# EasyEDA Pro project 2230506226.epro

# Schematic SCH_1
Board Name: Board1; Create Date: 2025-04-08; Page Name: P1; Project Name: SCH; Schematic Name: SCH_1; Update Date: 2025-04-08; Company: 嘉立创EDA; Page Size: A4; Version: V1.0
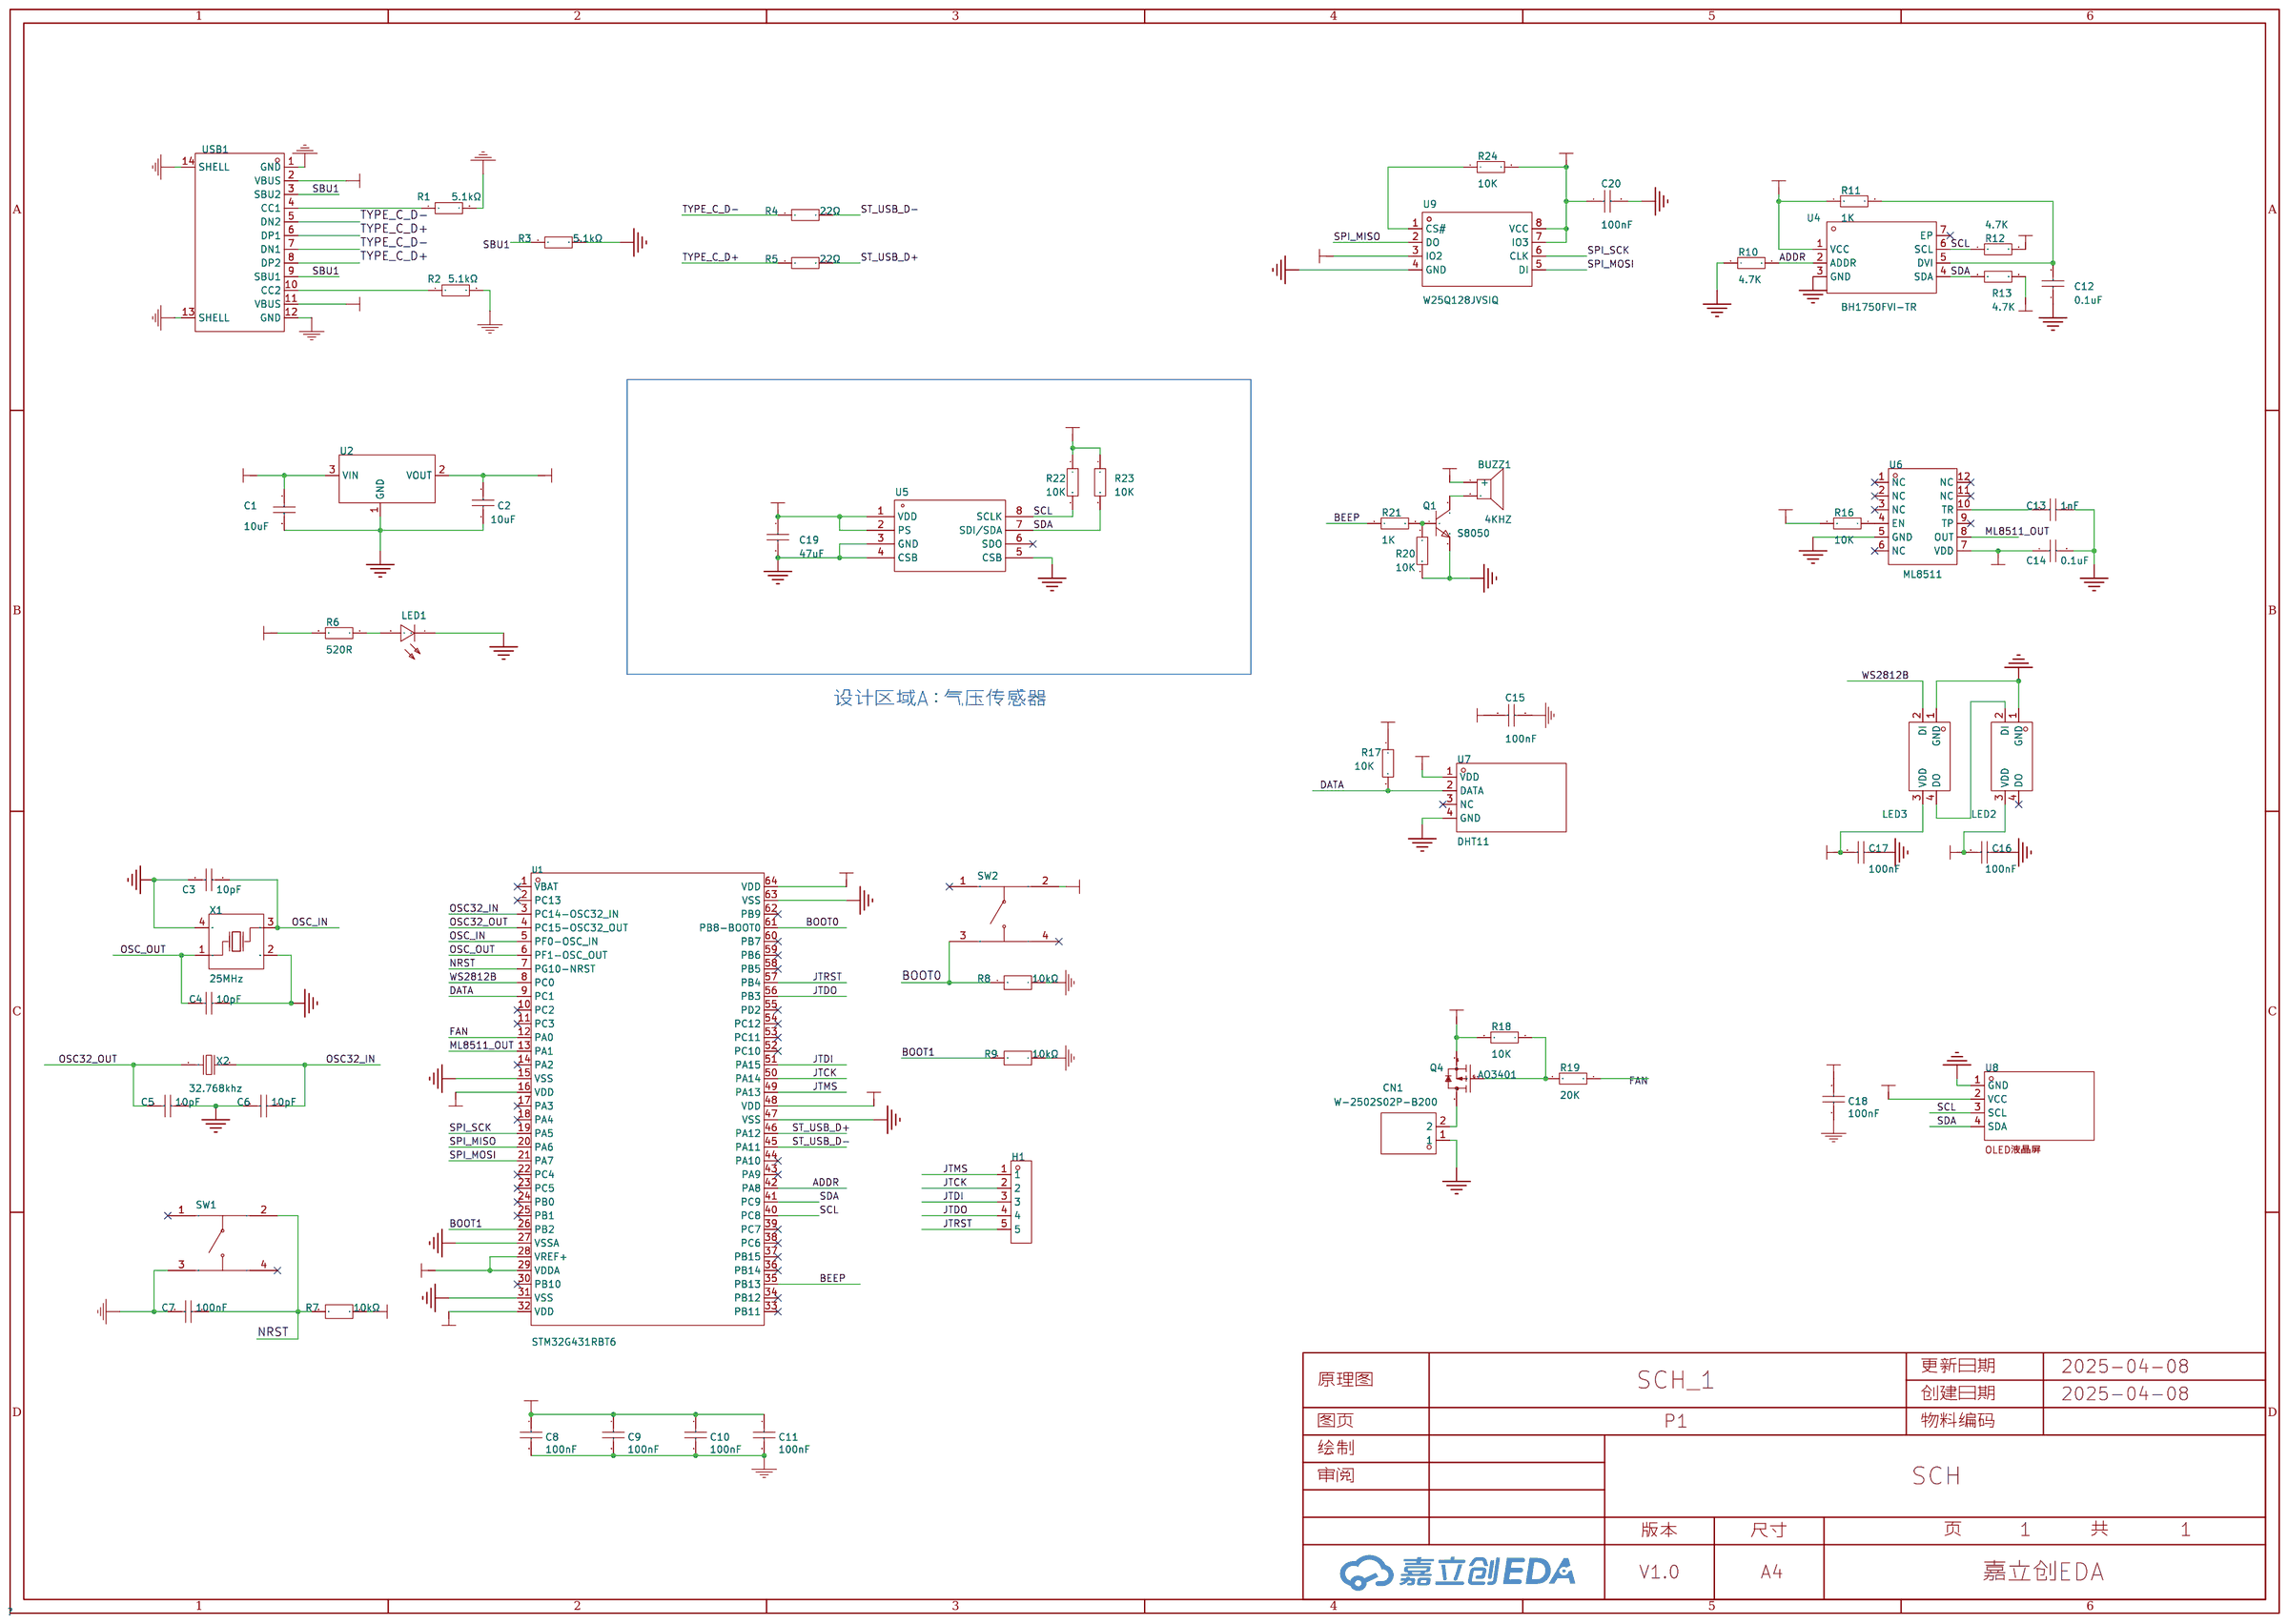
[diagram p0: schematic sheet]

## Parts
BUZZ1  4KHZ  [BUZ-TH_BD12.0-P7.60-D0.6-FD]
C1  10uF  [C0805]
C2  10uF  [C0805]
C3  10pF  [C0805]
C4  10pF  [C0805]
C5  10pF  [C0805]
C6  10pF  [C0805]
C7  100nF  [C0805]
C8  100nF  [C0805]
C9  100nF  [C0805]
C10  100nF  [C0805]
C11  100nF  [C0805]
C12  0.1uF  [C0805]
C13  1nF  [C0805]
C14  0.1uF  [C0805]
C15  100nF  [C0805]
C16  100nF  [C0805]
C17  100nF  [C0805]
C18  100nF  [C0805]
C19  47uF  [C0805]
C20  100nF  [C0805]
CN1  W-2502S02P-B200  [CONN-TH_2P-P2.54_2501S-2P]
H1  -  [5P排针]
LED1  NCD0603R1  [LED0603-RD_RED]
LED2  XL-5050RGBC-WS2812B  [LED-SMD_4P-L5.0-W5.0-BL_XL-5050RGBC]
LED3  XL-5050RGBC-WS2812B  [LED-SMD_4P-L5.0-W5.0-BL_XL-5050RGBC]
Q1  S8050  [SOT-23-3_L2.9-W1.3-P1.90-LS2.4-BR]
Q4  AO3401  [SOT-23-3_L2.9-W1.3-P1.90-LS2.4-BR]
R1  5.1kΩ  [R0805]
R2  5.1kΩ  [R0805]
R3  5.1kΩ  [R0805]
R4  22Ω  [R0805]
R5  22Ω  [R0805]
R6  520R  [R0805]
R7  10kΩ  [R0805]
R8  10kΩ  [R0805]
R9  10kΩ  [R0805]
R10  4.7K  [R0805]
R11  1K  [R0805]
R12  4.7K  [R0805]
R13  4.7K  [R0805]
R16  10K  [R0805]
R17  10K  [R0805]
R18  10K  [R0805]
R19  20K  [R0805]
R20  10K  [R0805]
R21  1K  [R0805]
R22  10K  [R0805]
R23  10K  [R0805]
R24  10K  [R0805]
SW1  TSA017A2540A07  [SW-SMD_4P-L4.2-W3.4-P2.15-LS5.2]
SW2  TSA017A2540A07  [SW-SMD_4P-L4.2-W3.4-P2.15-LS5.2]
U1  STM32G431RBT6  [LQFP-64_L10.0-W10.0-P0.50-LS12.0-BL]
U2  AMS1117-3.3(XBLW)  [SOT-223-3_L6.5-W3.4-P2.30-LS7.0-BR-1]
U4  BH1750FVI-TR  [WSOF-6_L2.6-W1.6-P0.50-TL-EP]
U5  -  [IC-8]
U6  ML8511  [DFN-12_L4.0-W3.7-P1.00-TL]
U7  DHT11  [SENSOR-TH_DHT11]
U8  -  [CONN-TH_4P-P2.54_POGO-4P]
U9  W25Q128JVSIQ  [SOIC-8_L5.3-W5.3-P1.27-LS8.0-BL]
USB1  TYPE-C 16PIN 2MD(073)  [USB-C-SMD_TYPE-C-6PIN-2MD-073]
X1  25MHz  [OSC-SMD_4P-L3.2-W2.5-BL]
X2  32.768kHz  [FC-135R_L3.2-W1.5]

## Library data of the parts
BUZZ1 = TMB12A05_C96093: 驱动方式:有源(内含驱动线路);构造类型:电磁式;频率:2.7kHz;声压(SPL):85dB;; LCSC Part Name: TMB12A05; Supplier Part: C96093; Manufacturer: 华能; Manufacturer Part: TMB12A05; Supplier Footprint: 插件,D=12mm; JLCPCB Part Class: Extended Part; Datasheet: https://atta.szlcsc.com/upload/public/pdf/source/20230426/A4FC10532558AA232D532AB83455FBA4.pdf; Supplier: LCSC; Oscillator Circuit: 有源(内含驱动线路); Technology Type: 电磁式; Operating Voltage: 4V~8V; Sound Pressure Level (SPL): 85dB; Diameter (φD): 12mm; Height: 9.8mm
C1-C6 C12-C14 C16 C17 C19 = CC0805KRX7R9BB104: 容值:100nF;精度:±10%;额定电压:50V;材质(温度系数):X7R;; LCSC Part Name: 100nF ±10% 50V; Supplier Part: C49678; Manufacturer: YAGEO(国巨); Supplier Footprint: 0805; JLCPCB Part Class: 基础库; Datasheet: https://atta.szlcsc.com/upload/public/pdf/source/20180224/C181747_15194369449651363981.pdf; Supplier: LCSC; Tolerance: ±10%; Voltage Rated: 50V; Temperature Coefficient: X7R
C7-C11 C15 C18 C20 = CC0603KRX7R9BB104: 容值:100nF;精度:±10%;额定电压:50V;材质(温度系数):X7R;; LCSC Part Name: 100nF ±10% 50V; Supplier Part: C14663; Manufacturer: YAGEO(国巨); Supplier Footprint: 0603; JLCPCB Part Class: Basic Part; Datasheet: https://atta.szlcsc.com/upload/public/pdf/source/20180910/C282072_33301C7F631E79921B82A8DAC6BCC5B3.pdf; Supplier: LCSC; Tolerance: ±10%; Voltage Rated: 50V; Temperature Coefficient: X7R
CN1 = W-2502S02P-B200: 插针结构:1x2P;间距:2.5mm;安装方式:-;参考系列:XH;总PIN数:2P;排数:1;每排PIN数:2;行距:-;触头材质:黄铜;; LCSC Part Name: 系列:XH 间距:2.5mm 1x2P; Supplier Part: C132463; Manufacturer: Ckmtw(灿科盟); Supplier Footprint: 插件,P=2.5mm; JLCPCB Part Class: Extended Part; Datasheet: https://atta.szlcsc.com/upload/public/pdf/source/20180112/C169006_15157258886881261764.pdf; Supplier: LCSC; Pins Structure: 1x2P; Pitch: 2.5mm; Reference Series: XH; Number of Pins: 2P; Number of Rows: 1; Number of PINs Per Row: 2; Contact Material: 黄铜
H1 = 5P排针: Supplier: LCSC; Supplier Part: C168673; Manufacturer: Amphenol ICC; Manufacturer Part: 68000-102HLF; _: 3
LED1 = NCD0603R1_C84263: 灯头类型:-;发光颜色:红色;正向电压(VF):1.6V~2.6V;功率:65mW;正向电流:20mA;主波长:615nm~630nm;二极管配置:独立二极管;透镜颜色:无色透明透镜;色温:-;发光强度:80mcd~220mcd;发光角度:130°;载带方式:-;工作温度:-30℃~+85℃;; Supplier Part: C84263; Manufacturer: 国星光电; Supplier Footprint: 0603; JLCPCB Part Class: Extended Part; Datasheet: https://atta.szlcsc.com/upload/public/pdf/source/20200820/C84263_DABC6A75E58F576973B407FDBA283D60.pdf; Supplier: LCSC; Emitted Color: 红色; Forward Voltage (VF): 1.6V~2.6V; Power Dissipation: 65mW; Forward Current: 20mA; Dominant Wavelength: 615nm~630nm; Diode Configuration: 独立二极管; Lens Color: 无色透明透镜; Luminous Intensity: 80mcd~220mcd; Viewing Angle: 130°; Operating Temperature: -30℃~+85℃
LED2 LED3 = XL-5050RGBC-WS2812B: 5050七彩幻彩透明贴片LED灯珠 5050 幻彩透明四脚 ws2812B 内置驱动IC; Supplier Part: C2843785; Manufacturer: XINGLIGHT(成兴光); Supplier Footprint: SMD5050; JLCPCB Part Class: Extended Part; Datasheet: https://atta.szlcsc.com/upload/public/pdf/source/20240412/E1004CAA80592E31D08BFE019083806F.pdf; Supplier: LCSC; Emitted Color: RGB三色; Diode Configuration: 共阳极; Dominant Wavelength: 618nm~623nm；520nm~525nm；467nm~472nm; Peak Wavelength: 525nm；623nm；472nm; Forward Current: 20mA; Forward Voltage (VF): 3.4V；3.4V；2.4V; Luminous Intensity: 143mcd；240mcd；845mcd; Power Dissipation: 50mW；50mW；45mW; Viewing Angle: 120°; Mounting Sytle: 正贴; Operating Temperature: -25℃~+80℃
Q1 = S8050_C20069125: 晶体管类型:NPN;集电极电流(Ic):500mA;集射极击穿电压(Vceo):25V;功率(Pd):300mW;直流电流增益(hFE@Ic,Vce):120@50mA,1.0V;; LCSC Part Name: NPN 电流:500mA 耐压:25V; Supplier Part: C20069125; Manufacturer: 宏迦橙; Supplier Footprint: SOT-23; JLCPCB Part Class: Extended Part; Datasheet: https://atta.szlcsc.com/upload/public/pdf/source/20240403/2D78449C96B6E27F13BF8BDF79E27159.pdf; Supplier: LCSC; Transistor Type: NPN; Collector Current (Ic): 500mA; Collector-Emitter Breakdown Voltage (Vceo): 25V; Power Dissipation (Pd): 300mW; DC Current Gain (hFE@Ic,Vce): 120@50mA,1.0V; Transition Frequency (fT): 100MHz; Collector Cut-Off Current (Icbo): 100nA; Collector-Emitter Saturation Voltage (VCE(sat)@Ic,Ib): 600mV@500mA,50mA; Operating Temperature: -55℃~+150℃
Q4 = AO3401_C181091: 类型:1个P沟道;漏源电压(Vdss):30V;连续漏极电流(Id):4.2A;功率(Pd):350mW;导通电阻(RDS(on)@Vgs,Id):65mΩ@10V,4.2A;阈值电压(Vgs(th)@Id):1.3V@250uA;; LCSC Part Name: 1个P沟道 耐压:30V 电流:4.2A; Supplier Part: C181091; Manufacturer: Hottech(合科泰); Supplier Footprint: SOT-23; JLCPCB Part Class: 扩展库; Datasheet: https://atta.szlcsc.com/upload/public/pdf/source/20180131/C181091_15173931948391329220.pdf; Supplier: LCSC; Type: 1个P沟道; Drain Source Voltage (Vdss): 30V; Continuous Drain Current (Id): 4.2A; Power Dissipation (Pd): 350mW; Drain Source On Resistance (RDS(on)@Vgs,Id): 65mΩ@10V,4.2A; Gate Threshold Voltage (Vgs(th)@Id): 1.3V@250uA
R1-R3 = 0603WAF5101T5E: 电阻类型:厚膜电阻;阻值:5.1kΩ;精度:±1%;功率:100mW;最大工作电压:75V;温度系数:±100ppm/℃;; LCSC Part Name: 5.1kΩ ±1% 100mW 厚膜电阻; Supplier Part: C23186; Manufacturer: UNI-ROYAL(厚声); Supplier Footprint: 0603; JLCPCB Part Class: Basic Part; Datasheet: https://atta.szlcsc.com/upload/public/pdf/source/20200306/C422600_1E6D84923E4A46A82E41ADD87F860B5C.pdf; Supplier: LCSC; Type: 厚膜电阻; Tolerance: ±1%; Power(Watts): 100mW; Overload Voltage (Max): 75V; Temperature Coefficient: ±100ppm/℃; Operating Temperature Range: -55℃~+155℃
R4 R5 = 0603WAF220JT5E: 电阻类型:厚膜电阻;阻值:22Ω;精度:±1%;功率:100mW;最大工作电压:75V;温度系数:±100ppm/℃;; LCSC Part Name: 22Ω ±1% 100mW 厚膜电阻; Supplier Part: C23345; Manufacturer: UNI-ROYAL(厚声); Supplier Footprint: 0603; JLCPCB Part Class: Basic Part; Datasheet: https://atta.szlcsc.com/upload/public/pdf/source/20200306/C422600_1E6D84923E4A46A82E41ADD87F860B5C.pdf; Supplier: LCSC; Type: 厚膜电阻; Tolerance: ±1%; Power(Watts): 100mW; Overload Voltage (Max): 75V; Temperature Coefficient: ±100ppm/℃; Operating Temperature Range: -55℃~+155℃
R6 R16 = RC0402FR-0710KL: 电阻类型:厚膜电阻;阻值:10kΩ;精度:±1%;功率:62.5mW;; LCSC Part Name: 10kΩ ±1% 62.5mW; Supplier Part: C60490; Manufacturer: YAGEO(国巨); Supplier Footprint: 0402; JLCPCB Part Class: Extended Part; Datasheet: https://atta.szlcsc.com/upload/public/pdf/source/20170606/1496716515432.pdf; Supplier: LCSC; Type: 厚膜电阻; Tolerance: ±1%; Power(Watts): 62.5mW; Temperature Coefficient: ±100ppm/℃; Overload Voltage (Max): 50V; Operating Temperature Range: -55℃~+155℃
R7-R9 = 0603WAF1002T5E: 电阻类型:厚膜电阻;阻值:10kΩ;精度:±1%;功率:100mW;最大工作电压:75V;温度系数:±100ppm/℃;; LCSC Part Name: 厚膜电阻 10kΩ ±1% 100mW; Supplier Part: C25804; Manufacturer: UNI-ROYAL(厚声); Supplier Footprint: 0603; JLCPCB Part Class: Basic Part; Datasheet: https://atta.szlcsc.com/upload/public/pdf/source/20200306/C422600_1E6D84923E4A46A82E41ADD87F860B5C.pdf; Supplier: LCSC; Type: 厚膜电阻; Tolerance: ±1%; Power(Watts): 100mW; Overload Voltage (Max): 75V; Temperature Coefficient: ±100ppm/℃; Operating Temperature Range: -55℃~+155℃
R10-R13 R17 R20-R24 = Res_0805: Supplier Footprint: 0805
R18 R19 = Res_0603: Supplier Footprint: 0603
SW1 SW2 = TSA017A2540A07: 按钮形状:椭圆形按钮;作用力:400gf;安装方式:立贴;开关长度:4.2mm;开关宽度:3.35mm;开关高度:2.5mm;触点电流:50mA;额定电压(AC):-;额定电压(DC):12V;机械寿命:-;; LCSC Part Name: 4.2*3.35*2.5mm 立贴 轻触开关; Supplier Part: C2888434; Manufacturer: BZCN(博众电气); Supplier Footprint: SMD; JLCPCB Part Class: 扩展库; Datasheet: https://atta.szlcsc.com/upload/public/pdf/source/20210906/F29F74F1A6DE5E6C38338EAD973C3529.pdf; Supplier: LCSC; Actuator Style: 椭圆形按钮; Operating Force: 400gf; Mounting Style: 立贴; Switch Length: 4.2mm; Switch Width: 3.35mm; Switch Height: 2.5mm; Contact Current: 50mA; Voltage Rating (DC): 12V; Actuator/Cap Color: 白色
U1 = STM32G431RBT6: CPU内核:ARM-M系列;程序存储容量:128KB;GPIO端口数量:52;工作电压范围:1.71V~3.6V;CPU最大主频:170MHz;; Supplier Part: C431633; Manufacturer: ST(意法半导体); Supplier Footprint: LQFP-64(10x10); JLCPCB Part Class: 扩展库; Datasheet: https://atta.szlcsc.com/upload/public/pdf/source/20190925/C431633_8068E60CC825A086DCCD86A4BDED9458.pdf; Supplier: LCSC; CPU Core: ARM-M系列; Program Storage Size: 128KB; GPIO Ports Number: 52; Operating Voltage Range: 1.71V~3.6V; CPU Maximum Speed: 170MHz; Operating Temperature Range: -40℃~+85℃; ADC (Bit): 12bit; DAC (Bit): 12bit; Watchdog: 有; Infrared Data Association: 有; Low-Voltage Detect: 有; Direct Memory Access: 有; Internal Oscillator: 有
U2 = AMS1117-3.3(XBLW)_C18906017: 最大输入电压:15V;输出电压:3.3V;最大输出电流:1A;电源纹波抑制比(PSRR):60dB;; Supplier Part: C18906017; Manufacturer: XBLW(芯伯乐); Supplier Footprint: SOT-223; JLCPCB Part Class: 扩展库; Datasheet: https://atta.szlcsc.com/upload/public/pdf/source/20231019/F4230EEFC48908FC91962BB59ACA9AD6.pdf; Supplier: LCSC; Maximum Input Voltage: 15V; Output Voltage: 3.3V; MAX Output Current: 1A; Power Supply Rejection Ratio (PSRR): 60dB; standby current: 4mA; Operating Temperature: -40℃~+125℃; Number of Outputs: 1
U4 = BH1750FVI-TR: 检测颜色:-;接口类型:I2C;分辨率(位):16;; Supplier Part: C78960; Manufacturer: ROHM(罗姆); Supplier Footprint: WSOF-6; Datasheet: https://atta.szlcsc.com/upload/public/pdf/source/20160723/1469258984787.pdf; Supplier: LCSC; Interface Type: I2C; Supply Voltage: 2.4V~3.6V; Resolution: 16; Operating Temperature: -40℃~+85℃
U5 = IC-8
U6 = ML8511_REFBOARD: Supplier Part: C19501581; Manufacturer: ROHM(罗姆); JLCPCB Part Class: 扩展库; Datasheet: https://atta.szlcsc.com/upload/public/pdf/source/20231221/86F2DBEAA739866045DC95770D30AEE3.pdf; Supplier: LCSC
U7 = DHT11: 新款电容式数字温湿度传感器,老款已停产16.1x12.6x5.8mm; Supplier: LCSC; Supplier Part: C117051; Manufacturer: 广州奥松; LCSC Part Name: DHT11  电容式传感器; Supplier Footprint: SIP-4; Datasheet: https://atta.szlcsc.com/upload/public/pdf/source/20170703/1499081238365.pdf
U8 = OLED液晶屏
U9 = W25Q128JVSIQ: 存储器构架(格式):FLASH;存储器接口类型:SPI - Dual/Quad I/O;存储器容量:128Mb (16M x 8);; Supplier Part: C97521; Manufacturer: WINBOND(华邦); Supplier Footprint: SOIC-8_208mil; JLCPCB Part Class: Basic Part; Datasheet: https://atta.szlcsc.com/upload/public/pdf/source/20170316/1489627409956.pdf; Supplier: LCSC; Memory Format: FLASH; Memory Interface: SPI - Dual/Quad I/O; Memory Size: 128Mb (16M x 8); Voltage - Supply: 2.7V ~ 3.6V
USB1 = TYPE-C 16PIN 2MD(073): 连接器类型:Type-C;标准:-;公母:母;端口数量:1;触点数量:16P;安装方式:卧贴;额定电流 - 电源:5A;工作温度范围:-25℃~+85℃;; LCSC Part Name: Type-C 母 卧贴; Supplier Part: C2765186; Manufacturer: SHOU HAN(首韩); Supplier Footprint: SMD; JLCPCB Part Class: Extended Part; Datasheet: https://atta.szlcsc.com/upload/public/pdf/source/20211123/39B17C16241EAC15C5E277BDA434118E.pdf; Supplier: LCSC; Connector Type: Type-C; Gender: 母; Number of Ports: 1; Number of Contacts: 16P; Mounting Style: 卧贴; Current Rating - Power (Max): 5A; Operating Temperature Range: -25℃~+85℃
X1 = X322525MOB4SI: 晶振类型:贴片晶振;频率:25MHz;常温频差:±10ppm;外接负载电容:12pF;频率稳定度(全温):±20ppm;; LCSC Part Name: 25MHz ±10ppm 12pF; Supplier Part: C9006; Manufacturer: YXC(扬兴晶振); Supplier Footprint: SMD3225-4P; JLCPCB Part Class: 基础库; Datasheet: https://atta.szlcsc.com/upload/public/pdf/source/20240329/19D5F850207469550BEB00D7DFEDBC7A.pdf; Supplier: LCSC; Crystal Type: 贴片晶振; Normal temperature Frequency Tolerance: ±10ppm; External load capacitor: 12pF; Frequency Stability(Full temperature range): ±20ppm; Operating Temperature: -40℃~+85℃
X2 = Q13FC1350000400: 频率:32.768kHz;晶振类型:贴片无源晶振;负载电容:12.5pF;等效串联电阻(ESR):70kΩ;频率公差:±20ppm;频率稳定度:-;工作温度:-40℃~+85℃;; LCSC Part Name: FC-135  32.768KHz ±20ppm 12.5pF; Supplier Part: C32346; Manufacturer: EPSON(爱普生); LCSC On Sale: 1; Supplier Footprint: SMD3215-2P; Price: 3.35; JLCPCB On Sale: 1; Datasheet: https://atta.szlcsc.com/upload/public/pdf/source/20190108/C32346_746D6B07EAF90824457A96480007685F.pdf; Supplier: LCSC; Operating Temperature: -40℃~+85℃; Crystal Type: 贴片无源晶振; Load Capacitance: 12.5pF; Equivalent Series Resistance (ESR): 70kΩ; Frequency Tolerance: ±20ppm

## Nets
3.3V: BUZZ1.1(+) C2.2 C8.1 C9.1 C10.1 C11.1 C14.1 C15.1 C18.1 C19.1 C20.1 R6.2 R7.1 R11.1 R12.2 R13.2 R16.2 R17.1 R22.1 R23.1 R24.2 SW2.2 U1.16(VDD) U1.28(VREF+) U1.29(VDDA) U1.32(VDD) U1.48(VDD) U1.64(VDD) U2.2(VOUT) U4.1(VCC) U5.1(VDD) U5.2(PS) U6.7(VDD) U7.1(VDD) U8.2(VCC) U9.3(IO2) U9.7(IO3) U9.8(VCC)
5V: C1.1 C16.2 C17.2 LED2.3(VDD) LED3.3(VDD) Q4.2(S) R18.2 U2.3(VIN) USB1.2(VBUS) USB1.11(VBUS)
GND: C1.2 C2.1 C3.1 C4.1 C5.1 C6.2 C7.2 C8.2 C9.2 C10.2 C11.2 C12.1 C13.1 C14.2 C15.2 C16.1 C17.1 C18.2 C19.2 C20.2 CN1.1 LED1.1(K) LED2.1(GND) LED3.1(GND) Q1.2 R1.2 R2.2 R3.2 R8.1 R9.1 R10.1 R20.2 SW1.3 U1.15(VSS) U1.27(VSSA) U1.31(VSS) U1.47(VSS) U1.63(VSS) U2.1(GND) U4.3(GND) U5.3(GND) U5.4(CSB) U5.5(CSB) U6.5(GND) U7.4(GND) U8.1(GND) U9.4(GND) USB1.1(GND) USB1.12(GND) USB1.13(SHELL) USB1.14(SHELL) X1.2(GND) X1.4(GND)
ADDR: R10.2 U1.42(PA8) U4.2(ADDR)
BEEP: R21.1 U1.35(PB13)
BOOT0: R8.2 SW2.3 U1.61(PB8-BOOT0)
BOOT1: R9.2 U1.26(PB2)
DATA: R17.2 U1.9(PC1) U7.2(DATA)
FAN: R19.1 U1.12(PA0)
JTCK: H1.2 U1.50(PA14)
JTDI: H1.3 U1.51(PA15)
JTDO: H1.4 U1.56(PB3)
JTMS: H1.1 U1.49(PA13)
JTRST: H1.5 U1.57(PB4)
ML8511_OUT: U1.13(PA1) U6.8(OUT)
NRST: C7.1 R7.2 SW1.2 U1.7(PG10-NRST)
OSC32_IN: C6.1 U1.3(PC14-OSC32_IN) X2.2
OSC32_OUT: C5.2 U1.4(PC15-OSC32_OUT) X2.1
OSC_IN: C3.2 U1.5(PF0-OSC_IN) X1.3(OSC2)
OSC_OUT: C4.2 U1.6(PF1-OSC_OUT) X1.1(OSC1)
SBU1: R3.1 USB1.3(SBU2) USB1.9(SBU1)
SCL: R12.1 R22.2 U1.40(PC8) U4.6(SCL) U5.8(SCLK) U8.3(SCL)
SDA: R13.1 R23.2 U1.41(PC9) U4.4(SDA) U5.7(SDI/SDA) U8.4(SDA)
SPI_MISO: U1.20(PA6) U9.2(DO)
SPI_MOSI: U1.21(PA7) U9.5(DI)
SPI_SCK: U1.19(PA5) U9.6(CLK)
ST_USB_D+: R5.2 U1.46(PA12)
ST_USB_D-: R4.2 U1.45(PA11)
TYPE_C_D+: R5.1 USB1.6(DP1) USB1.8(DP2)
TYPE_C_D-: R4.1 USB1.5(DN2) USB1.7(DN1)
WS2812B: LED3.2(DI) U1.8(PC0)
$1N2884: R1.1 USB1.4(CC1)
$1N2893: R2.1 USB1.10(CC2)
$1N3702: C12.2 R11.2 U4.5(DVI)
$1N3835: LED1.2(A) R6.1
$1N4038: CN1.2 Q4.3(D)
$1N4040: Q4.1(G) R18.1 R19.2
$1N4351: C13.2 U6.10(TR)
$1N4422: R16.1 U6.4(EN)
$1N4931: LED2.2(DI) LED3.4(DO)
$1N5246: Q1.1 R20.1 R21.2
$1N5250: BUZZ1.2 Q1.3
$1N13142: R24.1 U9.1(CS#)

Not connected (* = marked no-connect by the designer): LED2 4(DO)*; SW1 1* 4*; SW2 1* 4*; U1 1(VBAT)* 2(PC13)* 10(PC2)* 11(PC3)* 14(PA2)* 17(PA3)* 18(PA4)* 22(PC4)* 23(PC5)* 24(PB0)* 25(PB1)* 30(PB10)* 33(PB11)* 34(PB12)* 36(PB14)* 37(PB15)* 38(PC6)* 39(PC7)* 43(PA9)* 44(PA10)* 52(PC10)* 53(PC11)* 54(PC12)* 55(PD2)* 58(PB5)* 59(PB6)* 60(PB7)* 62(PB9)*; U4 7(EP)*; U5 6(SDO)*; U6 1(NC)* 2(NC)* 3(NC)* 6(NC)* 9(TP)* 11(NC)* 12(NC)*; U7 3(NC)*

## Notes on the sheet
- 设计区域A：气压传感器

# Board PCB_1
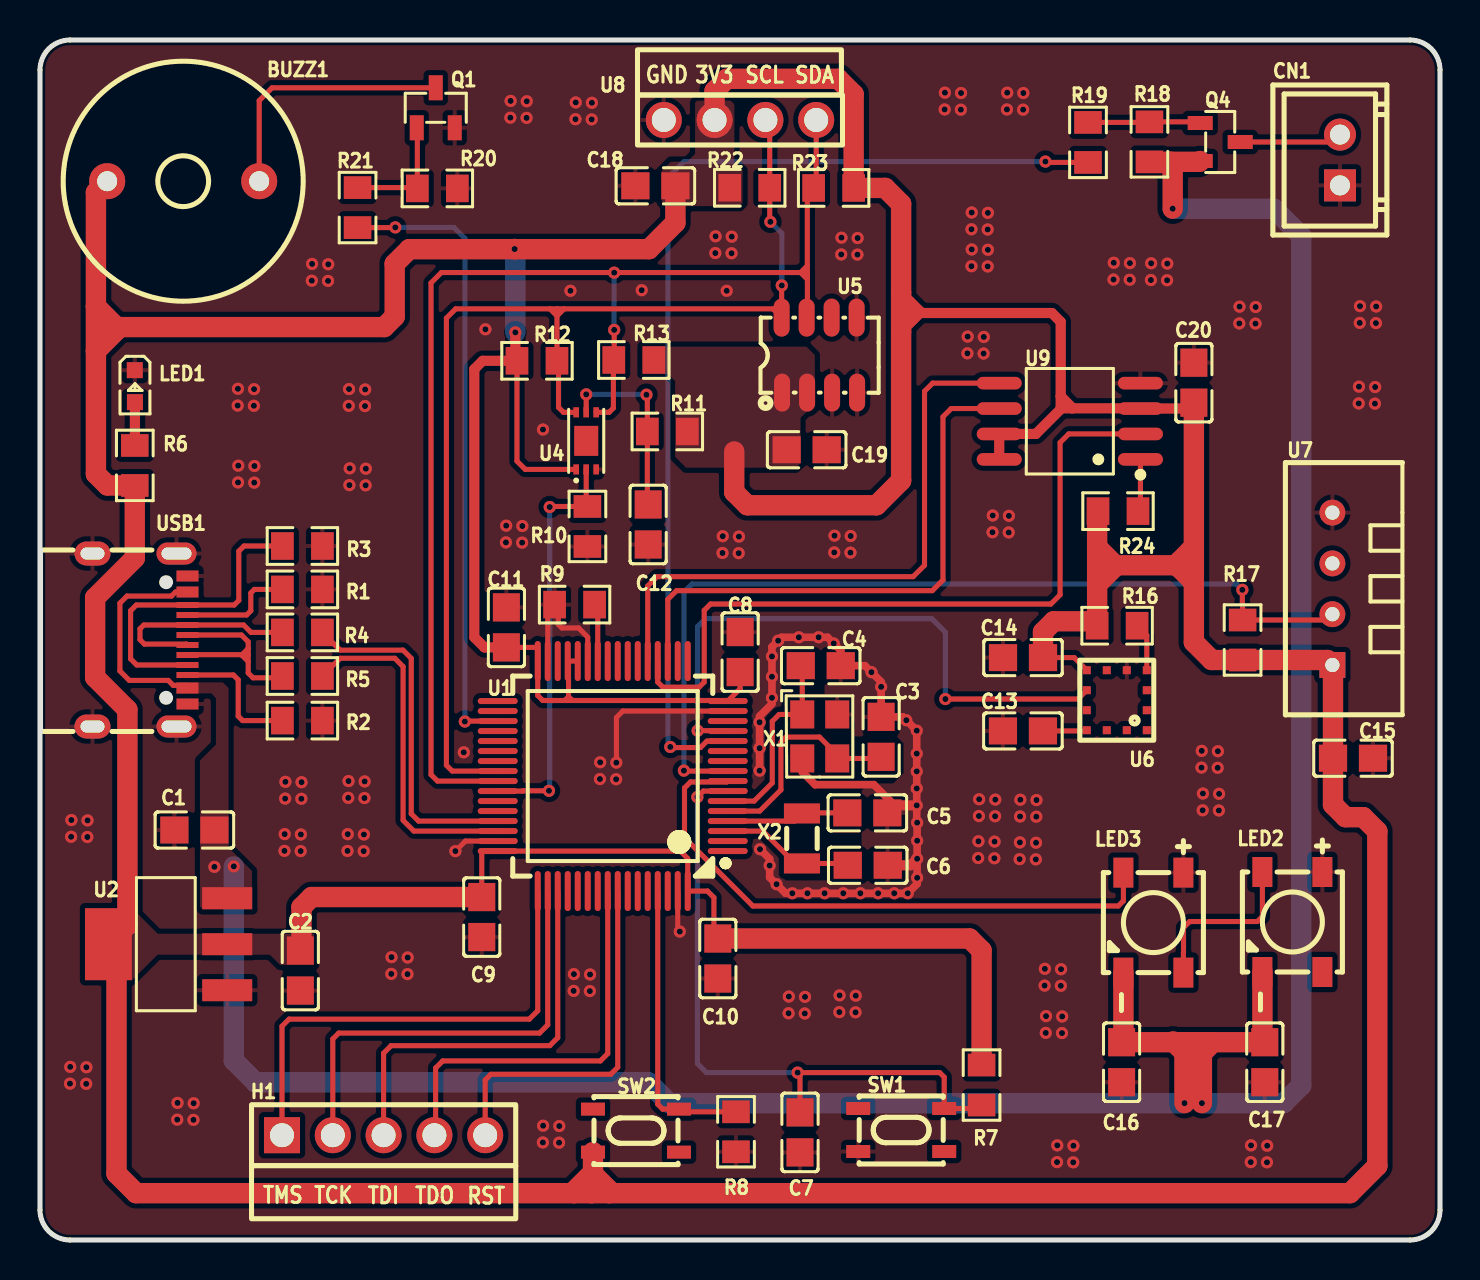
[diagram p1: board, top side]
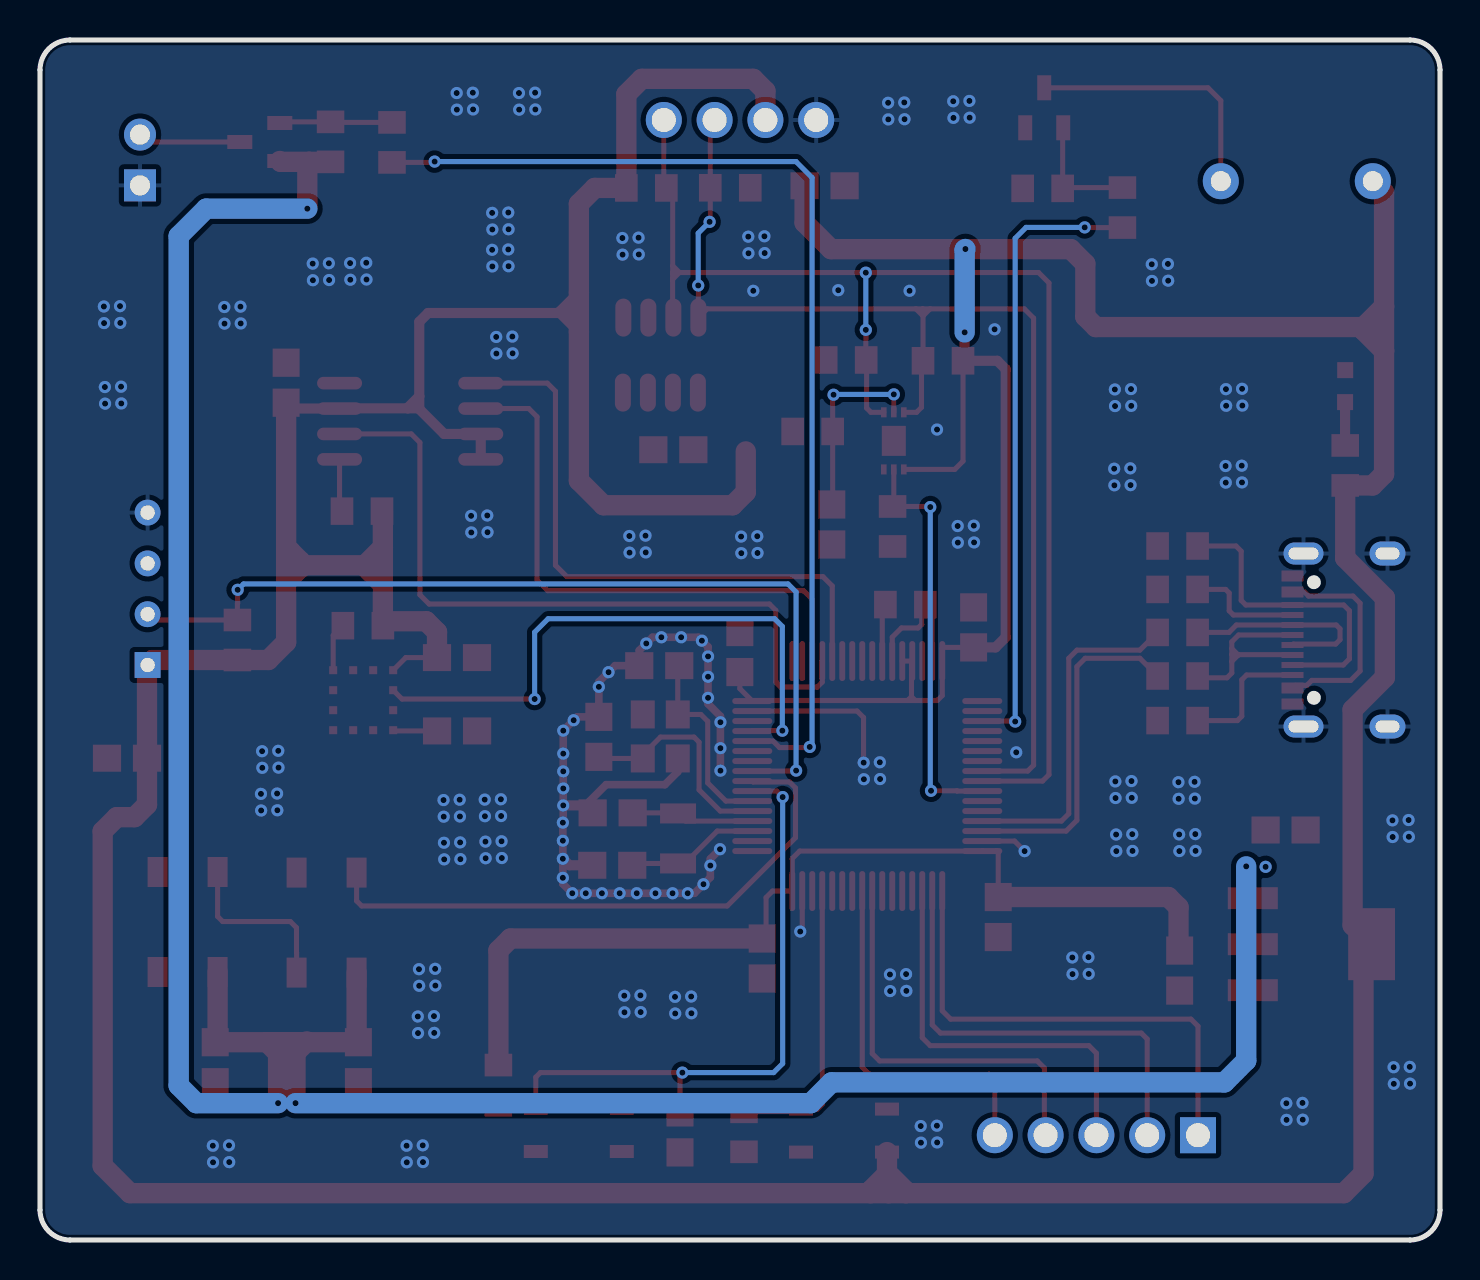
[diagram p2: board, bottom side, seen from below]

Outline 70 x 60 mm; copper layers: Top Layer, Bottom Layer. Coordinates in mm from the lower left corner of the outline.
Outline path: 0,58.5 0,1.5 arc(0.44,0.44) 1.5,0 68.5,0 arc(69.56,0.44) 70,1.5 70,58.5 arc(69.56,59.56) 68.5,60 1.5,60 arc(0.44,59.56) 0,58.5
Stack: Top Layer 0.035mm / Dielectric1 1.51mm FR4 er 4.5 / Bottom Layer 0.035mm

## Design rules (mm)
net ST_USB_D-: USB1
net TYPE_C_D-: USB
net ST_USB_D+: USB1
net TYPE_C_D+: USB
template: 自定义配置
spacing copperThickness1oz (default): track to track 0.178, other pairs 0.152 to 0.203
spacing copperThickness2oz: track to track 0.203, other pairs 0.152 to 0.3
track width copperThickness1oz (default): min 0.254, default 0.254, max 2.54
track width pwr: min 0.203, default 1.016, max 2.54
differential pair differentialPair (default): width min 0.127, default 0.254, max 2.54; gap min 0.152, default 0.152
via viaSize (default): diameter min 0.61, default 0.61, max 10; hole min 0.305, default 0.305, max 6.299
net 3.3V uses pwr
net GND uses pwr
net 5V uses pwr

## Placement (name value [footprint] x y rotation side)
BUZZ1  4KHZ  [BUZ-TH_BD12.0-P7.60-D0.6-FD]  7.16 52.94 0 top
C1  10uF  [C0805]  7.72 20.5 180 top
C2  10uF  [C0805]  13.02 13.47 90 top
C3  10pF  [C0805]  42.06 25.16 270 top
C4  10pF  [C0805]  39.04 28.72 180 top
C5  10pF  [C0805]  41.37 21.36 180 top
C6  10pF  [C0805]  41.39 18.74 0 top
C7  100nF  [C0805]  38 5.38 270 top
C8  100nF  [C0805]  35.01 29.4 90 top
C9  100nF  [C0805]  22.09 16.15 270 top
C10  100nF  [C0805]  33.89 14.07 270 top
C11  100nF  [C0805]  23.32 30.63 90 top
C12  0.1uF  [C0805]  30.41 35.78 90 top
C13  1nF  [C0805]  49.15 25.45 0 top
C14  0.1uF  [C0805]  49.15 29.12 180 top
C15  100nF  [C0805]  65.65 24.09 0 top
C16  100nF  [C0805]  54.08 8.89 90 top
C17  100nF  [C0805]  61.24 8.89 90 top
C18  100nF  [C0805]  30.77 52.71 180 top
C19  47uF  [C0805]  38.33 39.51 0 top
C20  100nF  [C0805]  57.69 42.87 90 top
CN1  W-2502S02P-B200  [CONN-TH_2P-P2.54_2501S-2P]  65 54 90 top
H1  -  [5P排针]  13.37 5.24 0 top
LED1  NCD0603R1  [LED0603-RD_RED]  4.74 42.69 270 top
LED2  XL-5050RGBC-WS2812B  [LED-SMD_4P-L5.0-W5.0-BL_XL-5050RGBC]  62.62 15.9 180 top
LED3  XL-5050RGBC-WS2812B  [LED-SMD_4P-L5.0-W5.0-BL_XL-5050RGBC]  55.67 15.87 180 top
Q1  S8050  [SOT-23-3_L2.9-W1.3-P1.90-LS2.4-BR]  19.79 56.61 270 top
Q4  AO3401  [SOT-23-3_L2.9-W1.3-P1.90-LS2.4-BR]  59.01 54.9 180 top
R1  5.1kΩ  [R0805]  13.12 32.53 0 top
R2  5.1kΩ  [R0805]  13.12 25.97 0 top
R3  5.1kΩ  [R0805]  13.12 34.7 0 top
R4  22Ω  [R0805]  13.12 30.38 0 top
R5  22Ω  [R0805]  13.12 28.2 0 top
R6  520R  [R0805]  4.74 38.73 270 top
R7  10kΩ  [R0805]  47.08 7.75 270 top
R8  10kΩ  [R0805]  34.8 5.41 90 top
R9  10kΩ  [R0805]  26.73 31.77 0 top
R10  4.7K  [R0805]  27.37 35.68 90 top
R11  1K  [R0805]  31.37 40.43 180 top
R12  4.7K  [R0805]  24.85 43.96 180 top
R13  4.7K  [R0805]  29.69 44 0 top
R16  10K  [R0805]  53.86 30.72 180 top
R17  10K  [R0805]  60.13 30 90 top
R18  10K  [R0805]  55.47 54.91 270 top
R19  20K  [R0805]  52.4 54.88 90 top
R20  10K  [R0805]  19.87 52.58 0 top
R21  1K  [R0805]  15.88 51.62 90 top
R22  10K  [R0805]  35.49 52.61 0 top
R23  10K  [R0805]  39.68 52.6 180 top
R24  10K  [R0805]  53.9 36.44 180 top
SW1  TSA017A2540A07  [SW-SMD_4P-L4.2-W3.4-P2.15-LS5.2]  43.06 5.5 0 top
SW2  TSA017A2540A07  [SW-SMD_4P-L4.2-W3.4-P2.15-LS5.2]  29.8 5.47 180 top
U1  STM32G431RBT6  [LQFP-64_L10.0-W10.0-P0.50-LS12.0-BL]  28.64 23.2 90 top
U2  AMS1117-3.3(XBLW)  [SOT-223-3_L6.5-W3.4-P2.30-LS7.0-BR-1]  6.39 14.79 0 top
U4  BH1750FVI-TR  [WSOF-6_L2.6-W1.6-P0.50-TL-EP]  27.31 39.96 90 top
U5  -  [IC-8]  38.99 44.24 0 top
U6  ML8511  [DFN-12_L4.0-W3.7-P1.00-TL]  53.84 26.99 180 top
U7  DHT11  [SENSOR-TH_DHT11]  64.62 32.56 90 top
U8  -  [CONN-TH_4P-P2.54_POGO-4P]  35 56 0 top
U9  W25Q128JVSIQ  [SOIC-8_L5.3-W5.3-P1.27-LS8.0-BL]  51.49 40.94 90 top
USB1  TYPE-C 16PIN 2MD(073)  [USB-C-SMD_TYPE-C-6PIN-2MD-073]  5 30 270 top
X1  25MHz  [OSC-SMD_4P-L3.2-W2.5-BL]  38.99 25.18 270 top
X2  32.768kHz  [FC-135R_L3.2-W1.5]  38.1 20.08 270 top

## Footprints (pads in the part's own frame, mm; a bottom-side part is the same pattern mirrored in y, then rotated)
5P排针
  rect 1.8x1.8 hole 1.2: 1(-1.27,0)
  round 1.8 hole 1.2: 2(1.27,0) 3(3.81,0) 4(6.35,0) 5(8.89,0)
BUZ-TH_BD12.0-P7.60-D0.6-FD
  round 1.8 hole 1: 1(-3.8,0) 2(3.8,0)
C0805
  rect 1.41x1.35 smd: 1(-1,0) 2(1,0)
CONN-TH_2P-P2.54_2501S-2P
  rect 1.6x1.6 hole 1: 1(-1.27,0)
  round 1.6 hole 1: 2(1.27,0)
CONN-TH_4P-P2.54_POGO-4P
  round 1.8 hole 1.2: 1(-3.81,0) 2(-1.27,0) 3(1.27,0) 4(3.81,0)
DFN-12_L4.0-W3.7-P1.00-TL
  rect 0.4x0.4 smd: 1(-1.5,1.5) 2(-1.5,0.5) 3(-1.5,-0.5) 4(-1.5,-1.5) 5(-0.5,-1.5) 6(0.5,-1.5) 7(1.5,-1.5) 8(1.5,-0.5) 9(1.5,0.5) 10(1.5,1.5) 11(0.5,1.5) 12(-0.5,1.5)
FC-135R_L3.2-W1.5
  rect 1.001x1.801 smd: 1(-1.25,0) 2(1.25,0)
IC-8
  oval 0.8x1.9 smd: 1(-1.882,-1.871) 2(-0.632,-1.871) 3(0.618,-1.871) 4(1.868,-1.871) 5(1.845,1.879) 6(0.596,1.879) 7(-0.654,1.879) 8(-1.905,1.879)
LED0603-RD_RED
  rect 0.8x0.8 smd: 1(-0.799,-0.004) 2(0.799,0.004)
LED-SMD_4P-L5.0-W5.0-BL_XL-5050RGBC
  rect 1x1.5 smd: 1(-1.5,-2.5) 2(1.5,-2.5) 3(1.5,2.5) 4(-1.5,2.5)
LQFP-64_L10.0-W10.0-P0.50-LS12.0-BL
  oval 0.3x2 smd: 1(-3.75,-5.75) 2(-3.25,-5.75) 3(-2.75,-5.75) 4(-2.25,-5.75) 5(-1.75,-5.75) 6(-1.25,-5.75) 7(-0.75,-5.75) 8(-0.25,-5.75) 9(0.25,-5.75) 10(0.75,-5.75) 11(1.25,-5.75) 12(1.75,-5.75) 13(2.25,-5.75) 14(2.75,-5.75) 15(3.25,-5.75) 16(3.75,-5.75) 33(3.75,5.75) 34(3.25,5.75) 35(2.75,5.75) 36(2.25,5.75) 37(1.75,5.75) 38(1.25,5.75) 39(0.75,5.75) 40(0.25,5.75) 41(-0.25,5.75) 42(-0.75,5.75) 43(-1.25,5.75) 44(-1.75,5.75) 45(-2.25,5.75) 46(-2.75,5.75) 47(-3.25,5.75) 48(-3.75,5.75)
  oval 2x0.3 smd: 17(5.75,-3.75) 18(5.75,-3.25) 19(5.75,-2.75) 20(5.75,-2.25) 21(5.75,-1.75) 22(5.75,-1.25) 23(5.75,-0.75) 24(5.75,-0.25) 25(5.75,0.25) 26(5.75,0.75) 27(5.75,1.25) 28(5.75,1.75) 29(5.75,2.25) 30(5.75,2.75) 31(5.75,3.25) 32(5.75,3.75) 49(-5.75,3.75) 50(-5.75,3.25) 51(-5.75,2.75) 52(-5.75,2.25) 53(-5.75,1.75) 54(-5.75,1.25) 55(-5.75,0.75) 56(-5.75,0.25) 57(-5.75,-0.25) 58(-5.75,-0.75) 59(-5.75,-1.25) 60(-5.75,-1.75) 61(-5.75,-2.25) 62(-5.75,-2.75) 63(-5.75,-3.25) 64(-5.75,-3.75)
OSC-SMD_4P-L3.2-W2.5-BL
  rect 1.4x1.2 smd: 1(-1.1,-0.875) 2(1.1,-0.875) 3(1.1,0.875) 4(-1.1,0.875)
R0805
  rect 1.133x1.377 smd: 1(-1,0) 2(1,0)
SENSOR-TH_DHT11
  rect 1.296x1.296 hole 0.711: 1(-3.81,0)
  round 1.296 hole 0.711: 2(-1.27,0) 3(1.27,0) 4(3.81,0)
SOIC-8_L5.3-W5.3-P1.27-LS8.0-BL
  oval 0.63x2.25 smd: 1(-1.905,-3.53) 2(-0.635,-3.53) 3(0.635,-3.53) 4(1.905,-3.53) 5(1.905,3.53) 6(0.635,3.53) 7(-0.635,3.53) 8(-1.905,3.53)
SOT-23-3_L2.9-W1.3-P1.90-LS2.4-BR
  rect 1.25x0.7 smd: 1(1,-0.95) 2(1,0.95) 3(-1,0)
SOT-223-3_L6.5-W3.4-P2.30-LS7.0-BR-1
  rect 2.5x1.1 smd: 1(2.97,-2.3) 2(2.97,0) 3(2.97,2.3)
  rect 2.34x3.6 smd: 2(-2.97,0)
SW-SMD_4P-L4.2-W3.4-P2.15-LS5.2
  rect 1.2x0.65 smd: 1(-2.15,1.075) 2(2.15,1.075) 3(-2.15,-1.075) 4(2.15,-1.075)
USB-C-SMD_TYPE-C-6PIN-2MD-073
  rect 0.55x1.1 smd: 1(-3.2,2.375) 2(-2.4,2.375) 11(2.4,2.375) 12(3.2,2.375)
  rect 0.3x1.1 smd: 3(-1.75,2.375) 4(-1.25,2.375) 5(-0.75,2.375) 6(-0.25,2.375) 7(0.25,2.375) 8(0.75,2.375) 9(1.25,2.375) 10(1.75,2.375)
  oval 1.1x2 hole 0.6x1.5: 13(-4.325,1.825) 14(4.325,1.825)
  oval 1.2x1.8 hole 0.6x1.2: 13(-4.325,-2.375) 14(4.325,-2.375)
WSOF-6_L2.6-W1.6-P0.50-TL-EP
  rect 0.505x0.28 smd: 1(-1.427,0.5) 2(-1.427,0) 3(-1.427,-0.5) 4(1.427,-0.5) 5(1.427,0) 6(1.427,0.5)
  rect 1.5x1.2 smd: 7(0,0)

## Nets
As in the schematic.

Pads without a net: LED2 4; SW1 1 4; SW2 1 4; U1 1 2 10 11 14 17 18 22 23 24 25 30 33 34 36 37 38 39 43 44 52 53 54 55 58 59 60 62; U4 7; U5 6; U6 1 2 3 6 9 11 12; U7 3

## Via types
v1: diameter 0.61, hole 0.305, Top Layer to Bottom Layer, 250 vias

## Routing (per net, layer and track width the routed paths; a pad name or vN(x,y) marks a point on that pad's centre or on a via; arc(x,y) is an arc through that point)
3.3V: length 392.6
  Top Layer w0.254: C8.1 35.01,27.57 U1.16 34.36,26.97 26.56,26.97 ; C11.1 24.85,29.63 24.89,29.59 U1.32 24.89,27.22 25.14,26.97 26.24,26.97 ; U1.28 U1.29 26.43,28.91 26.43,27.17 ; U4.1 24.26,38.53 23.85,38.94 R12.2 ; 26.56,26.97 26.24,26.97 ; 26.56,26.97 26.56,27.03 26.43,27.17 ; 26.24,26.97 26.43,27.17 ; C9.1 22.09,19.38 22.15,19.45 U1.48 32.01,19.45 32.39,19.07 U1.64 33.37,17.45 33.7,17.12 33.7,15.29 ; U6.7 51.71,29.12 C14.1
  Top Layer w0.508: 51.04,42.18 51.04,41.6 51.06,41.57 ; 51.04,42.18 51.04,45.91 50.59,46.35 44,46.35 ; 51.04,42.18 51.61,41.61 51.61,41.58 ; U9.8 U9.7 49.79,40.3 51.06,41.57 ; C20.1 57.4,41.57 U9.3 55.01,41.58 51.61,41.58 ; 51.06,41.57 51.07,41.58 51.61,41.58 ; 44,46.35 44,46.43 43.06,47.38 ; 44,46.35 43.06,45.41 ; 44,46.35 43.32,46.35 ; v1(23.77,45.38) 23.77,44.04 R12.2 22.13,43.96 21.71,43.54 21.71,30.14 22.22,29.63 C11.1
  Top Layer w1.016: 56.99,33.74 53.76,33.74 ; 56.99,33.74 56.99,33.94 57.49,34.44 57.69,34.44 ; 56.99,33.74 56.99,33.59 57.55,33.03 57.69,33.03 ; 53.76,33.74 52.86,34.64 ; 53.76,33.74 53.06,33.74 ; 53.76,33.74 53.76,33.68 52.86,32.78 ; 27.42,3.16 26.71,2.44 26.71,2.34 ; 34.71,39.43 34.71,37.39 35.36,36.74 41.83,36.74 43.06,37.97 43.06,51.81 42.26,52.6 R23.1 40.68,57.29 39.91,58.06 34.34,58.06 33.73,57.45 U8.2 ; 52.86,34.64 52.86,32.78 ; 52.86,34.64 52.86,36.4 R24.2 ; 23.74,49.54 23.74,49.55 v1(23.73,49.55) ; 23.74,49.54 18.47,49.54 17.73,48.81 17.73,46.17 17.21,45.65 3.83,45.65 ; 23.74,49.54 30.45,49.54 31.77,50.86 C18.1 ; 27.65,3.29 28.47,2.48 28.47,2.34 ; 26.71,2.34 4.81,2.34 3.83,3.32 3.83,14.39 U2.2 4.37,15.74 4.37,26.52 2.76,28.13 2.76,32.11 4.74,34.1 R6.2 3.37,37.73 2.8,38.3 2.8,44.45 ; 26.71,2.34 27.57,2.34 ; C10.1 46.48,15.07 47.08,14.48 R7.1 ; SW2.2 27.65,2.42 27.57,2.34 ; 57.69,33.03 57.69,34.44 ; 57.69,33.03 57.69,29.89 58.58,29 R17.1 64.37,29 U7.1 64.65,28.72 C15.1 64.65,21.77 65.27,21.14 66.16,21.14 66.87,20.44 66.87,3.71 65.5,2.34 28.47,2.34 ; 2.8,46.67 2.8,44.45 ; 2.8,46.67 3.83,45.65 ; 2.8,46.67 2.8,52.38 BUZZ1.1 ; 2.8,44.45 3.83,45.48 3.83,45.65 ; 3.83,45.65 3.18,45.65 3.08,45.54 ; 52.57,30.94 50.69,30.94 50.15,30.4 C14.1 ; 28.47,2.34 27.57,2.34 ; 57.69,34.44 C20.1 ; 52.86,32.78 R16.2 ; C9.1 13.58,17.15 13.07,16.64 13.07,14.53 C2.2
  Bottom Layer w1.016: v1(23.77,45.38) 23.77,49.51 v1(23.73,49.55)
5V: length 149.5
  Top Layer w0.254: USB1.2 6.78,32.4 6.57,32.2 4.35,32.2 4,31.84 4,28.45 4.47,27.98 6.41,27.98 6.66,27.73 7.24,27.73 USB1.11
  Top Layer w1.016: v1(58.1,6.84) 58.1,9.34 58.65,9.89 ; 56.55,53.91 57.97,53.91 Q4.2 ; 56.55,53.91 56.63,53.82 v1(56.63,51.57) ; 56.55,53.91 R18.2 ; v1(57.22,6.84) 57.22,9.34 ; 58.65,9.89 C17.2 61.12,10.01 LED2.3 ; 58.65,9.89 56.73,9.89 56.71,9.88 ; 56.7,9.89 56.66,9.93 ; 56.7,9.89 C16.2 54.17,9.98 LED3.3 ; 56.7,9.89 56.71,9.88 ; 56.71,9.88 57.26,9.32
  Bottom Layer w1.016: v1(58.1,6.84) 62.18,6.84 63.07,7.72 63.07,50.2 61.69,51.57 v1(56.63,51.57) ; v1(57.22,6.84) 31.46,6.84 30.42,7.88 10.78,7.88 9.69,8.97 v1(9.69,18.68)
  vias: v1(8.72,18.66)
GND: length 62.7
  Top Layer w0.254: v1(20.77,19.44) 21.27,19.95 U1.47 ; U1.15 29.15,26.45 28.82,26.12 28.82,23.87 v1(28.82,23.87) ; v1(31.99,15.42) 31.89,15.52 U1.63 ; U1.27 27.39,30.14 26.93,30.6 26.09,30.6 25.91,30.78 25.91,31.59 R9.1 25.39,31.43 U1.31
  Top Layer w0.381: v1(36,19.54) 36.48,19.06 v1(36.48,18.72) 36.48,18.13 v1(36.83,17.79) 37.28,17.34 v1(37.62,17.34) v1(38.37,17.34) v1(39.23,17.34) v1(40.16,17.34) v1(41.02,17.34) v1(41.91,17.34) v1(42.71,17.34) v1(43.39,17.34) 43.86,17.81 v1(43.86,19.06) v1(43.86,19.97) v1(43.86,20.87) 43.84,20.89 v1(43.84,21.73) v1(43.84,22.58) v1(43.84,23.43) v1(43.84,24.32) v1(43.84,25.47) 43.15,26.16 C3.1 42.06,27.91 v1(41.57,28.39) 41.25,28.72 C4.1 40.04,29.48 v1(39.69,29.83) 39.38,30.14 v1(38.93,30.14) v1(37.94,30.14) 37.08,30.14 36.6,29.66 v1(36.6,29.18) v1(36.6,28.16) 36.6,26.81 35.98,26.19 v1(35.98,25.89) v1(35.98,24.59) v1(35.98,23.47) ; 42.51,21.85 42.51,21.95 41.69,22.77 38.76,22.77 38.11,23.41 X1.2
  Top Layer w0.508: C5.1 42.69,21.68 ; 42.74,21.73 v1(43.84,21.73) ; v1(43.86,19.06) 43.53,18.74 C6.2
  vias: v1(1.51,8.66) v1(1.5,7.82) v1(1.57,21) v1(1.56,20.16) v1(2.32,8.64) v1(2.31,7.81) v1(2.38,20.98) v1(2.37,20.15) v1(6.88,6.86) v1(6.86,6.02) v1(7.68,6.84) v1(7.67,6.01) v1(9.9,42.56) v1(9.88,41.72) v1(9.91,38.72) v1(9.9,37.88) v1(10.7,42.54) v1(10.69,41.71) v1(10.72,38.7) v1(10.71,37.87) v1(12.23,20.29) v1(12.22,19.46) v1(12.27,22.91) v1(12.26,22.07) v1(13.04,20.28) v1(13.03,19.45) v1(13.08,22.89) v1(13.07,22.06) v1(13.6,48.8) v1(13.59,47.97) v1(14.41,48.79) v1(14.4,47.95) v1(15.44,41.71) v1(15.43,22.95) v1(15.41,22.11) v1(15.39,20.29) v1(15.37,19.45) v1(15.45,42.55) v1(15.48,38.58) v1(15.47,37.74) v1(16.25,41.7) v1(16.23,22.93) v1(16.22,22.1) v1(16.19,20.27) v1(16.19,19.44) v1(16.26,42.53) v1(16.29,38.56) v1(16.28,37.73) v1(17.58,14.14) v1(17.56,13.3) v1(18.38,14.12) v1(18.37,13.29) v1(21.19,24.38) v1(22.27,45.53) v1(23.31,35.72) v1(23.3,34.88) v1(23.53,56.95) v1(23.52,56.12) v1(24.12,35.7) v1(24.11,34.87) v1(24.34,56.94) v1(24.33,56.11) v1(25.15,40.52) v1(25.14,4.88) v1(25.16,5.72) v1(25.96,5.7) v1(25.95,4.87) v1(26.52,47.46) v1(26.7,13.29) v1(26.68,12.46) v1(26.79,56.88) v1(26.77,56.04) v1(27.5,13.28) v1(27.49,12.45) v1(27.59,56.86) v1(27.58,56.03) v1(28.01,23.89) v1(28,23.05) v1(28.81,23.04) v1(30.09,47.49) v1(33.78,50.19) v1(33.77,49.35) v1(34.14,35.19) v1(34.12,34.35) v1(34.34,47.46) v1(34.59,50.17) v1(34.58,49.34) v1(34.95,35.17) v1(34.94,34.34) v1(36.6,27.11) v1(36.91,29.97) v1(37.44,12.17) v1(37.43,11.34) v1(38.25,12.16) v1(38.24,11.33) v1(39.73,35.22) v1(39.71,34.38) v1(39.98,12.23) v1(39.97,11.39) v1(40.07,50.12) v1(40.06,49.28) v1(40.53,35.2) v1(40.52,34.37) v1(40.79,12.22) v1(40.78,11.38) v1(40.88,50.1) v1(40.87,49.27) v1(42.06,27.66) v1(43.32,25.99) v1(43.86,18.11) v1(45.25,57.37) v1(45.23,56.53) v1(46.04,56.52) v1(46.05,57.35) v1(46.38,45.17) v1(46.37,44.33) v1(46.59,51.37) v1(46.57,50.54) v1(46.59,49.53) v1(46.57,48.69) v1(46.94,21.2) v1(46.92,19.94) v1(46.91,19.1) v1(46.96,22.04) v1(47.19,45.15) v1(47.18,44.32) v1(47.39,51.36) v1(47.38,50.53) v1(47.39,49.51) v1(47.38,48.68) v1(47.64,36.23) v1(47.62,35.39) v1(47.73,19.92) v1(47.72,19.09) v1(47.76,22.02) v1(47.75,21.19) v1(48.35,56.53) v1(48.36,57.37) v1(48.45,36.21) v1(48.44,35.38) v1(49.02,22.01) v1(49,21.18) v1(48.99,19.88) v1(48.98,19.04) v1(49.17,57.35) v1(49.16,56.52) v1(49.82,22) v1(49.81,21.17) v1(49.8,19.86) v1(49.79,19.03) v1(50.24,13.56) v1(50.23,12.72) v1(50.3,11.19) v1(50.29,10.36) v1(50.86,4.73) v1(50.85,3.89) v1(51.04,12.71) v1(51.05,13.54) v1(51.11,11.18) v1(51.1,10.35) v1(51.67,4.71) v1(51.66,3.88) v1(53.69,48.86) v1(53.68,48.02) v1(54.5,48.84) v1(54.49,48.01) v1(55.54,48) v1(55.56,48.84) v1(56.37,48.82) v1(56.35,47.99) v1(58.09,24.46) v1(58.07,23.62) v1(58.15,22.32) v1(58.13,21.49) v1(58.9,24.44) v1(58.88,23.61) v1(58.94,21.48) v1(58.95,22.31) v1(59.98,46.67) v1(59.96,45.83) v1(60.54,3.89) v1(60.55,4.73) v1(60.78,46.65) v1(60.77,45.82) v1(61.35,3.88) v1(61.36,4.71) v1(65.95,42.67) v1(65.94,41.83) v1(66,46.69) v1(65.99,45.85) v1(66.75,41.82) v1(66.81,46.67) v1(66.8,45.84) v1(66.76,42.65)
ADDR: length 20.5
  Top Layer w0.254: U1.42 24.14,22.45 24.16,22.46 v1(25.45,22.46) ; v1(25.49,36.65) 25.52,36.68 R10.2 27.31,36.74 U4.2
  Bottom Layer w0.254: v1(25.45,22.46) 25.49,22.5 v1(25.49,36.65)
BEEP: length 31.4
  Top Layer w0.254: v1(21.24,25.92) 21.27,25.95 U1.35 ; R21.1 17.76,50.62 v1(17.77,50.63)
  Bottom Layer w0.254: v1(21.24,25.92) 21.24,50.08 20.7,50.63 v1(17.77,50.63)
BOOT0: length 14.7
  Top Layer w0.254: U1.61 30.89,6.79 31.13,6.54 SW2.3 32.09,6.41 R8.2
BOOT1: length 2.9
  Top Layer w0.254: U1.26 27.89,31.61 R9.2
DATA: length 45.5
  Top Layer w0.254: v1(32.19,23.47) 32.22,23.45 U1.9 ; U7.2 64.33,31 R17.2 60.13,31.82 60.12,31.83 v1(60.12,32.51)
  Bottom Layer w0.254: v1(32.19,23.47) 32.19,32.4 32.6,32.8 59.82,32.8 v1(60.12,32.51)
FAN: length 52.9
  Top Layer w0.254: R19.1 50.31,53.88 v1(50.27,53.92) ; v1(31.51,24.65) 31.55,24.62 33.02,24.62 33.35,24.95 U1.12
  Bottom Layer w0.254: v1(31.51,24.65) 31.4,24.77 31.4,53.12 32.2,53.92 v1(50.27,53.92)
JTCK: length 22.5
  Top Layer w0.254: H1.2 14.64,10.05 14.94,10.35 24.98,10.35 25.39,10.76 U1.50
JTDI: length 20.5
  Top Layer w0.254: U1.51 25.89,10.12 25.49,9.72 17.56,9.72 17.18,9.34 H1.3
JTDO: length 20.4
  Top Layer w0.254: U1.56 28.39,9.32 28.02,8.95 20.13,8.95 19.78,8.6 19.78,5.3 H1.4
JTMS: length 24.5
  Top Layer w0.254: U1.49 24.89,11.46 24.47,11.04 12.45,11.04 12.1,10.69 H1.1
JTRST: length 18.5
  Top Layer w0.254: U1.57 28.89,8.64 28.54,8.29 22.54,8.29 22.26,8 H1.5
ML8511_OUT: length 30.1
  Top Layer w0.254: U1.13 34.37,25.47 v1(32.88,25.47) ; v1(45.27,27.05) 51.9,27.05 U6.8
  Bottom Layer w0.254: v1(45.27,27.05) 45.27,30.39 44.59,31.06 33.27,31.06 32.88,30.68 v1(32.88,25.47)
NRST: length 33
  Top Layer w0.254: v1(32.87,22.15) 33.17,22.45 U1.7 ; 47,6.57 SW1.2 45.21,8.14 44.98,8.37 v1(37.88,8.37) 38,8.25 C7.1
  Bottom Layer w0.254: v1(32.87,22.15) 32.87,8.82 33.32,8.37 v1(37.88,8.37)
OSC32_IN: length 6.7
  Top Layer w0.254: C6.1 40.3,18.83 X2.2 37.76,18.83 36.14,20.45 U1.3
OSC32_OUT: length 6.2
  Top Layer w0.254: C5.2 38.13,21.36 X2.1 37.72,20.95 U1.4
OSC_IN: length 11.2
  Top Layer w0.254: C3.2 41.98,24.08 X1.3 39.86,24.26 38.97,25.15 37.3,25.15 37.05,24.89 37.05,22.51 35.99,21.45 U1.5
OSC_OUT: length 9.8
  Top Layer w0.254: U1.6 35.71,21.95 36.61,22.85 36.61,25.93 36.96,26.28 X1.1 38.11,28.64 C4.2
SBU1: length 15.8
  Top Layer w0.254: USB1.9 4.84,28.75 4.53,29.06 4.53,31.46 4.82,31.75 USB1.3 9.71,31.75 9.94,31.98 9.94,34.44 10.2,34.7 R3.1
SCL: length 59.4
  Top Layer w0.254: U4.6 26.17,41.38 25.93,41.63 25.93,43.88 R12.1 25.85,46.2 ; 25.5,46.56 20.78,46.56 20.32,46.09 20.32,23.74 20.61,23.45 U1.40 ; 25.5,46.56 25.85,46.2 ; 25.5,46.56 25.87,46.56 ; 26.2,46.56 36.64,46.56 U5.8 37.08,47.72 v1(37.09,47.73) ; 26.2,46.56 25.87,46.56 ; 26.2,46.56 25.85,46.2 ; 25.87,46.56 25.85,46.54 25.85,46.2 ; U8.3 36.49,55.78 R22.2 36.49,50.94 v1(36.52,50.91)
  Bottom Layer w0.254: v1(37.09,47.73) 37.09,50.34 v1(36.52,50.91)
SDA: length 66.3
  Top Layer w0.254: 38.37,48.71 38.37,48.37 ; 38.37,48.71 38.37,52.09 38.91,52.64 ; 38.37,48.71 38.03,48.37 ; 38.37,48.37 38.37,48.37 38.37,48.03 ; 38.37,48.37 38.03,48.37 ; U5.7 38.37,46.16 38.37,48.03 ; U4.4 28.46,41.38 28.67,41.6 28.67,43.95 29,43.95 ; v1(28.71,45.51) 28.71,44.02 R13.1 ; 38.03,48.37 20.07,48.37 19.55,47.86 19.55,23.27 19.87,22.95 U1.41 ; 38.03,48.37 38.37,48.03 ; U8.4 38.81,52.73 R23.2
  Bottom Layer w0.254: v1(28.71,45.51) v1(28.71,48.37)
SPI_MISO: length 37.1
  Top Layer w0.254: U9.2 51.44,40.3 51.01,39.87 51.01,32.26 50.54,31.8 33.53,31.8 33.21,31.48 33.21,27.9 32.96,27.64 31.14,27.64 30.89,27.9 U1.20
SPI_MOSI: length 30.6
  Top Layer w0.254: U9.5 44.63,42.84 44.23,42.44 44.23,33.74 43.66,33.17 30.85,33.17 30.39,32.7 U1.21
SPI_SCK: length 28.4
  Top Layer w0.254: U1.19 31.39,32.03 31.83,32.47 44.62,32.47 45.15,33 45.15,41.16 45.56,41.57 U9.6
ST_USB_D+: length 17.2
  Top Layer w0.254: R5.2 15.01,29.09 17.74,29.09 18.16,28.67 18.16,20.98 18.69,20.45 U1.46
ST_USB_D-: length 17.2
  Top Layer w0.254: R4.2 15.01,29.49 18.15,29.49 18.56,29.08 18.56,21.31 18.93,20.95 U1.45
TYPE_C_D+: length 10.5
  Top Layer w0.254: 10.41,29.27 10.41,28.93 ; 10.41,28.93 10.41,28.35 10.65,28.11 12.03,28.11 R5.1 ; 10.41,28.93 10.09,29.25 ; 10.41,29.57 10.41,29.91 10.07,30.25 USB1.6 ; 10.41,29.57 10.41,29.28 10.38,29.25 10.09,29.25 ; 10.41,29.57 10.09,29.25 ; 10.09,29.25 10.07,29.27 7.39,29.27 USB1.8
TYPE_C_D-: length 10.4
  Top Layer w0.254: R4.1 10.55,30.38 10.18,30.75 USB1.5 5.19,30.75 5,30.56 5,30.02 5.22,29.8 7.33,29.8 USB1.7
WS2812B: length 29.7
  Top Layer w0.254: U1.8 34.34,22.9 32.53,22.9 32.22,22.6 32.22,20.12 35.64,16.7 53.92,16.7 54.17,16.96 LED3.2
$1N2884: length 5.8
  Top Layer w0.254: USB1.4 10.33,31.25 10.54,31.46 10.54,32.35 10.72,32.53 R1.1
$1N2893: length 6.8
  Top Layer w0.254: USB1.10 9.67,28.25 9.91,28.01 9.91,26.19 10.13,25.97 R2.1
$1N3702: length 9.5
  Top Layer w0.254: U4.5 v1(27.31,42.28) ; 30.53,36.74 30.37,36.9 R11.2 30.37,42.22 v1(30.32,42.26)
  Bottom Layer w0.254: v1(27.31,42.28) 30.3,42.28 v1(30.32,42.26)
$1N3835: length 2.2
  Top Layer w0.508: LED1.2 4.75,39.73 R6.1
$1N4038: length 5.1
  Top Layer w0.254: Q4.3 64.63,54.9 CN1.2
$1N4040: length 5.6
  Top Layer w0.254: R19.2 55.44,55.88 R18.1 57.95,55.91 Q4.1
$1N4351: length 2.2
  Top Layer w0.254: C13.2 52.3,25.45 U6.10
$1N4422: length 2.4
  Top Layer w0.254: U6.4 55.34,30.23 R16.1
$1N4931: length 8.6
  Top Layer w0.254: LED3.4 57.17,14.37 57.18,14.38 57.18,15.62 57.48,15.92 60.87,15.92 61.12,16.18 LED2.2
$1N5246: length 6
  Top Layer w0.254: Q1.1 18.87,55.58 R20.1 18.83,52.62 R21.2
$1N5250: length 13.1
  Top Layer w0.254: Q1.3 11.6,57.61 10.96,56.97 BUZZ1.2
$1N13142: length 2.6
  Top Layer w0.254: R24.1 55.02,36.56 U9.1

## Copper pours and planes (outline as drawn; the poured copper is in the pictures)
3.3V on Top Layer: 30.16,44.67 38.74,44.67 38.74,38.61 30.16,38.61
3.3V on Top Layer: 31.06,56.99 35.13,56.99 35.13,51.69 31.06,51.69
3.3V on Top Layer: 2.27,16.57 13.7,16.57 13.7,13.01 2.27,13.01
5V on Top Layer: 6.82,27.88 10.62,27.88 10.62,16.53 6.82,16.53
GND on Top Layer: -4.56,65.85 75.83,65.85 77.19,64.49 77.19,-7.73 78.55,-9.09 -3,-9.09 -4.56,-7.53
GND on Bottom Layer: -5.18,67.53 77.34,67.53 80.07,64.8 80.07,-0.02 77.54,-2.55 -5.77,-2.55 -6.35,-1.96 -6.35,66.36

## Text on the board
Top Silkscreen Layer: TMS | TCK | TDI | TDO | RST | GND | 3V3 | SCL | SDA
